# EAGLE schematic Business Card (EAGLE 8.6.0)
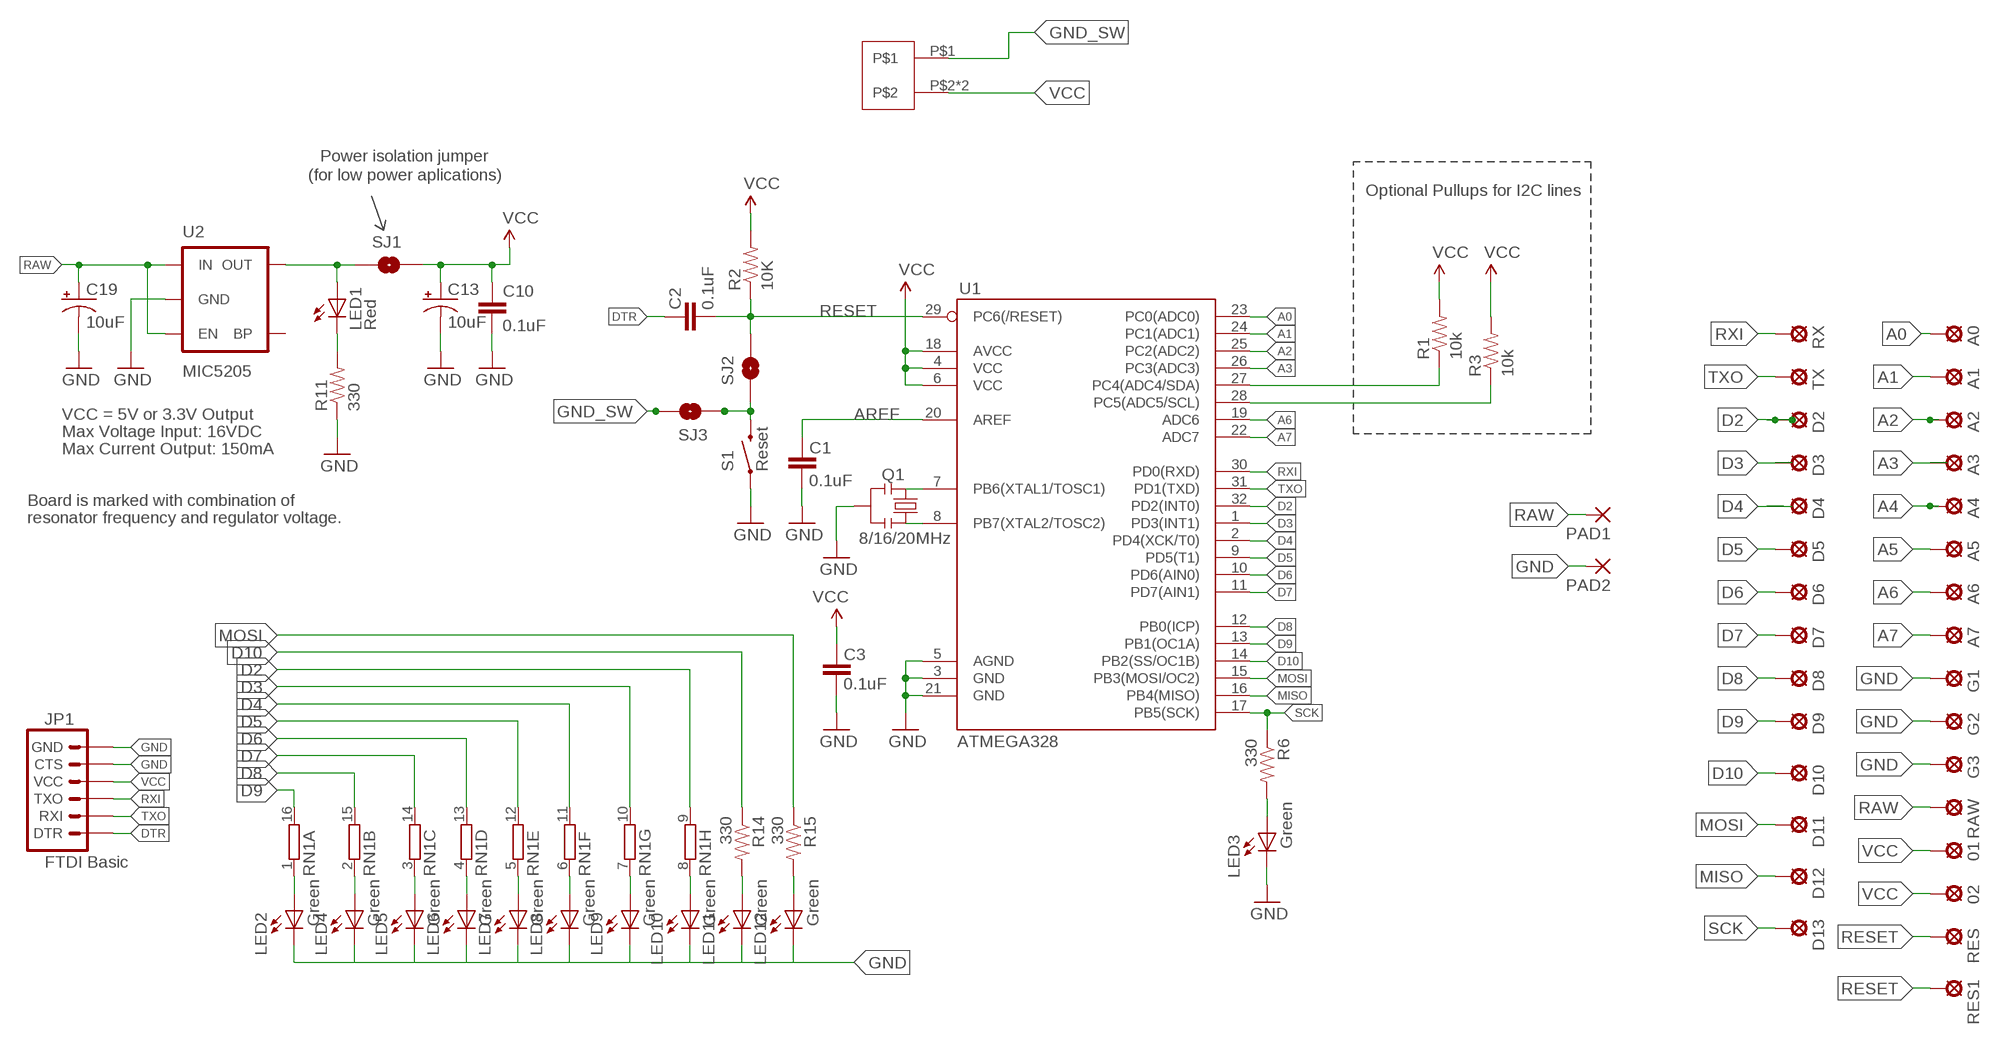
[diagram p0: schematic, sheet 1]

## Parts
01  SE13  [SE13]
02  SE13  [SE13]
A0  SE13  [SE13]
A1  SE13  [SE13]
A2  SE13  [SE13]
A3  SE13  [SE13]
A4  SE13  [SE13]
A5  SE13  [SE13]
A6  SE13  [SE13]
A7  SE13  [SE13]
C1  0.1uF  CAP0603-CAP  [0603-CAP]
C2  0.1uF  CAP0603-CAP  [0603-CAP]
C3  0.1uF  CAP0603-CAP  [0603-CAP]
C10  0.1uF  CAP0603-CAP  [0603-CAP]
C13  10uF  CAP_POL1206  [EIA3216]
C19  10uF  CAP_POL1206  [EIA3216]
D2  SE13  [SE13]
D3  SE13  [SE13]
D4  SE13  [SE13]
D5  SE13  [SE13]
D6  SE13  [SE13]
D7  SE13  [SE13]
D8  SE13  [SE13]
D9  SE13  [SE13]
D10  SE13  [SE13]
D11  SE13  [SE13]
D12  SE13  [SE13]
D13  SE13  [SE13]
G1  SE13  [SE13]
G2  SE13  [SE13]
G3  SE13  [SE13]
GND_SW  CR2032  [CR2032]
JP1  FTDI Basic  ARDUINO_SERIAL_PROGRAMPTH  [1X06]
LED1  Red  LED  [0603-LED-ALT1]
LED2  Green  LED  [0603-LED-ALT1]
LED3  Green  LED  [0603-LED-ALT1]
LED4  Green  LED  [0603-LED-ALT1]
LED5  Green  LED  [0603-LED-ALT1]
LED6  Green  LED  [0603-LED-ALT1]
LED7  Green  LED  [0603-LED-ALT1]
LED8  Green  LED  [0603-LED-ALT1]
LED9  Green  LED  [0603-LED-ALT1]
LED10  Green  LED  [0603-LED-ALT1]
LED11  Green  LED  [0603-LED-ALT1]
LED12  Green  LED  [0603-LED-ALT1]
PAD1  2,54/1,1  [2,54/1,1]
PAD2  2,54/1,1  [2,54/1,1]
Q1  8/16/20MHz  RESONATOR1:1  [RESONATOR-SMD-1:1]
R1  10k  RESISTOR0603-RES  [0603-RES]
R2  10K  RESISTOR0603-RES  [0603-RES]
R3  10k  RESISTOR0603-RES  [0603-RES]
R6  330  RESISTOR0603-RES  [0603-RES]
R11  330  RESISTOR0603-RES  [0603-RES]
R14  330  RESISTOR0603-RES  [0603-RES]
R15  330  RESISTOR0603-RES  [0603-RES]
RAW  SE13  [SE13]
RES  SE13  [SE13]
RES1  SE13  [SE13]
RN1  8R-NSOMC  [SOMC16]
RX  SE13  [SE13]
S1  Reset  SWITCH-MOMENTARY-2SMD-ALT01  [TACTILE-SWITCH-SMD-ALT01]
SJ1  SOLDERJUMPERNC  [SJ_2S]
SJ2  SOLDERJUMPERNC  [SJ_2S]
SJ3  SOLDERJUMPERNC  [SJ_2S]
TX  SE13  [SE13]
U1  ATMEGA328  ATMEGA168  [TQFP32-08]
U2  MIC5205  V_REG_LDOSMD  [SOT23-5]

## Nets
A0: A0.MP U1.23(PC0(ADC0))
A1: A1.MP U1.24(PC1(ADC1))
A2: A2.MP U1.25(PC2(ADC2))
A3: A3.MP U1.26(PC3(ADC3))
A4: A4.MP R1.1 U1.27(PC4(ADC4/SDA))
A5: A5.MP R3.1 U1.28(PC5(ADC5/SCL))
A6: A6.MP U1.19(ADC6)
A7: A7.MP U1.22(ADC7)
AREF: C1.2 U1.20(AREF)
D2: D2.MP RN1.9 U1.32(PD2(INT0))
D3: D3.MP RN1.10 U1.1(PD3(INT1))
D4: D4.MP RN1.11 U1.2(PD4(XCK/T0))
D5: D5.MP RN1.12 U1.9(PD5(T1))
D6: D6.MP RN1.13 U1.10(PD6(AIN0))
D7: D7.MP RN1.14 U1.11(PD7(AIN1))
D8: D8.MP RN1.15 U1.12(PB0(ICP))
D9: D9.MP RN1.16 U1.13(PB1(OC1A))
D10: D10.MP R14.1 U1.14(PB2(SS/OC1B))
DTR: C2.2 JP1.1(DTR)
GND [vcc]: C1.1 C3.1 C10.2 C13.C(-) C19.C(-) G1.MP G2.MP G3.MP JP1.5(CTS) JP1.6(GND) LED2.C LED3.C LED4.C LED5.C LED6.C LED7.C LED8.C LED9.C LED10.C LED11.C LED12.C PAD2.1(P) Q1.2 R11.1 S1.1 S1.2 U1.3(GND) U1.5(AGND) U1.21(GND) U2.2(GND)
GND_SW [vcc]: GND_SW.P$1 SJ3.2
MISO: D12.MP U1.16(PB4(MISO))
MOSI: D11.MP R15.1 U1.15(PB3(MOSI/OC2))
N$1: Q1.3 U1.8(PB7(XTAL2/TOSC2))
N$2: Q1.1 U1.7(PB6(XTAL1/TOSC1))
N$3: LED1.A SJ1.1 U2.5(OUT)
N$4: LED1.C R11.2
N$5: LED2.A RN1.1
N$6: LED4.A RN1.2
N$7: LED3.A R6.2
N$8: LED5.A RN1.3
N$9: LED6.A RN1.4
N$10: LED7.A RN1.5
N$11: LED8.A RN1.6
N$12: LED9.A RN1.7
N$13: LED10.A RN1.8
N$14: LED11.A R14.2
N$15: LED12.A R15.2
N$16: S1.3 S1.4 SJ2.1 SJ3.1
RAW [vcc]: C19.A(+) PAD1.1(P) RAW.MP U2.1(IN) U2.3(EN)
RESET: C2.1 R2.1 RES1.MP RES.MP SJ2.2 U1.29(PC6(/RESET))
RXI: JP1.3(TXO) RX.MP U1.30(PD0(RXD))
SCK: D13.MP R6.1 U1.17(PB5(SCK))
TXO: JP1.2(RXI) TX.MP U1.31(PD1(TXD))
VCC: 01.MP 02.MP C3.2 C10.1 C13.A(+) GND_SW.P$2 GND_SW.P$3 JP1.4(VCC) R1.2 R2.2 R3.2 SJ1.2 U1.4(VCC) U1.6(VCC) U1.18(AVCC)
Unconnected: U2.4(BP)

## Notes on the sheet
- Power isolation jumper
- (for low power aplications)
- Optional Pullups for I2C lines
- VCC = 5V or 3.3V Output
- Max Voltage Input: 16VDC
- Max Current Output: 150mA
- Board is marked with combination of
- resonator frequency and regulator voltage.

## Library data of the parts
01 02 A0 A1-A7 D2-D13 G1-G3 RAW RES RES1 RX TX = solpad:SE13: SOLDER PAD E1542, drill 1,3mm, distributor Buerklin, 07F815
C1-C3 C10 = SparkFun:CAP: Capacitor Standard 0603 ceramic capacitor, and 0.1" leaded capacitor.
C13 C19 = SparkFun:CAP_POL: Capacitor Polarized These are standard SMD and PTH capacitors. Normally 10uF, 47uF, and 100uF in electrolytic and tantalum varieties. Always verify the external diameter of the through hole cap, it varies with capacity, voltage, and manufacturer. The EIA devices should be standard.
GND_SW = CR2032:CR2032
JP1 = SparkFun:ARDUINO_SERIAL_PROGRAM
LED1-LED12 = Testing:LED: LEDs Standard schematic elements and footprints for 5mm, 3mm, 1206, and 0603 sized LEDs. 5mm - Spark Fun Electronics SKU : COM-00529 (and others)
PAD1 PAD2 = wirepad:2,54/1,1: THROUGH-HOLE PAD
Q1 = Testing:RESONATOR: Resonator Small SMD resonator. This is the itty bitty 10/20MHz resonators with built in caps. CSTCE10M0G55 and CSTCE20M0V53. Footprint for SMD has been used in SFE production for years, and does work okay. 1:1 is an attempt to get larger fillets on the sides so it will be easier to inspect these solders in our AOI machine. The pads have been minimized to match the actual metal under the resonator. To see this relation, it includes an image import of the bottom side of the component. Imported to scale on layer 200.
R1-R3 R6 R11 R14 R15 = SparkFun:RESISTOR: Resistor Basic schematic elements and footprints for 0603, 1206, and PTH resistors.
RN1 = resistor-dil:8R-N: DIL RESISTOR; OC_FARNELL: unknown; OC_NEWARK: unknown
S1 = Testing:SWITCH-MOMENTARY-2: Various NO switches- pushbuttons, reed, etc
SJ1-SJ3 = SparkFun-Passives:SOLDERJUMPER: Solder Jumper Standard SMD solder jumper. Used to automate production. Two varients : Normally Open and Normally Closed are the same, but have different paste layers. NC will have a large amount of paste and should jumper during reflow.
U1 = SparkFun:ATMEGA168
U2 = SparkFun:V_REG_LDO: Voltage Regulator LDO Standard 150mA LDO voltage regulator in SOT-23 layout. Micrel part MIC5205. BP (by-pass) pin is used to lower output noise with 470pF cap.

## Net classes
0 default: width 0.203 mm, drill 0.102 mm, clearance 0.203 mm
1 vcc: width 0.254 mm